# EAGLE design Adafruit Metro M4 Express (EAGLE 6.6.0)
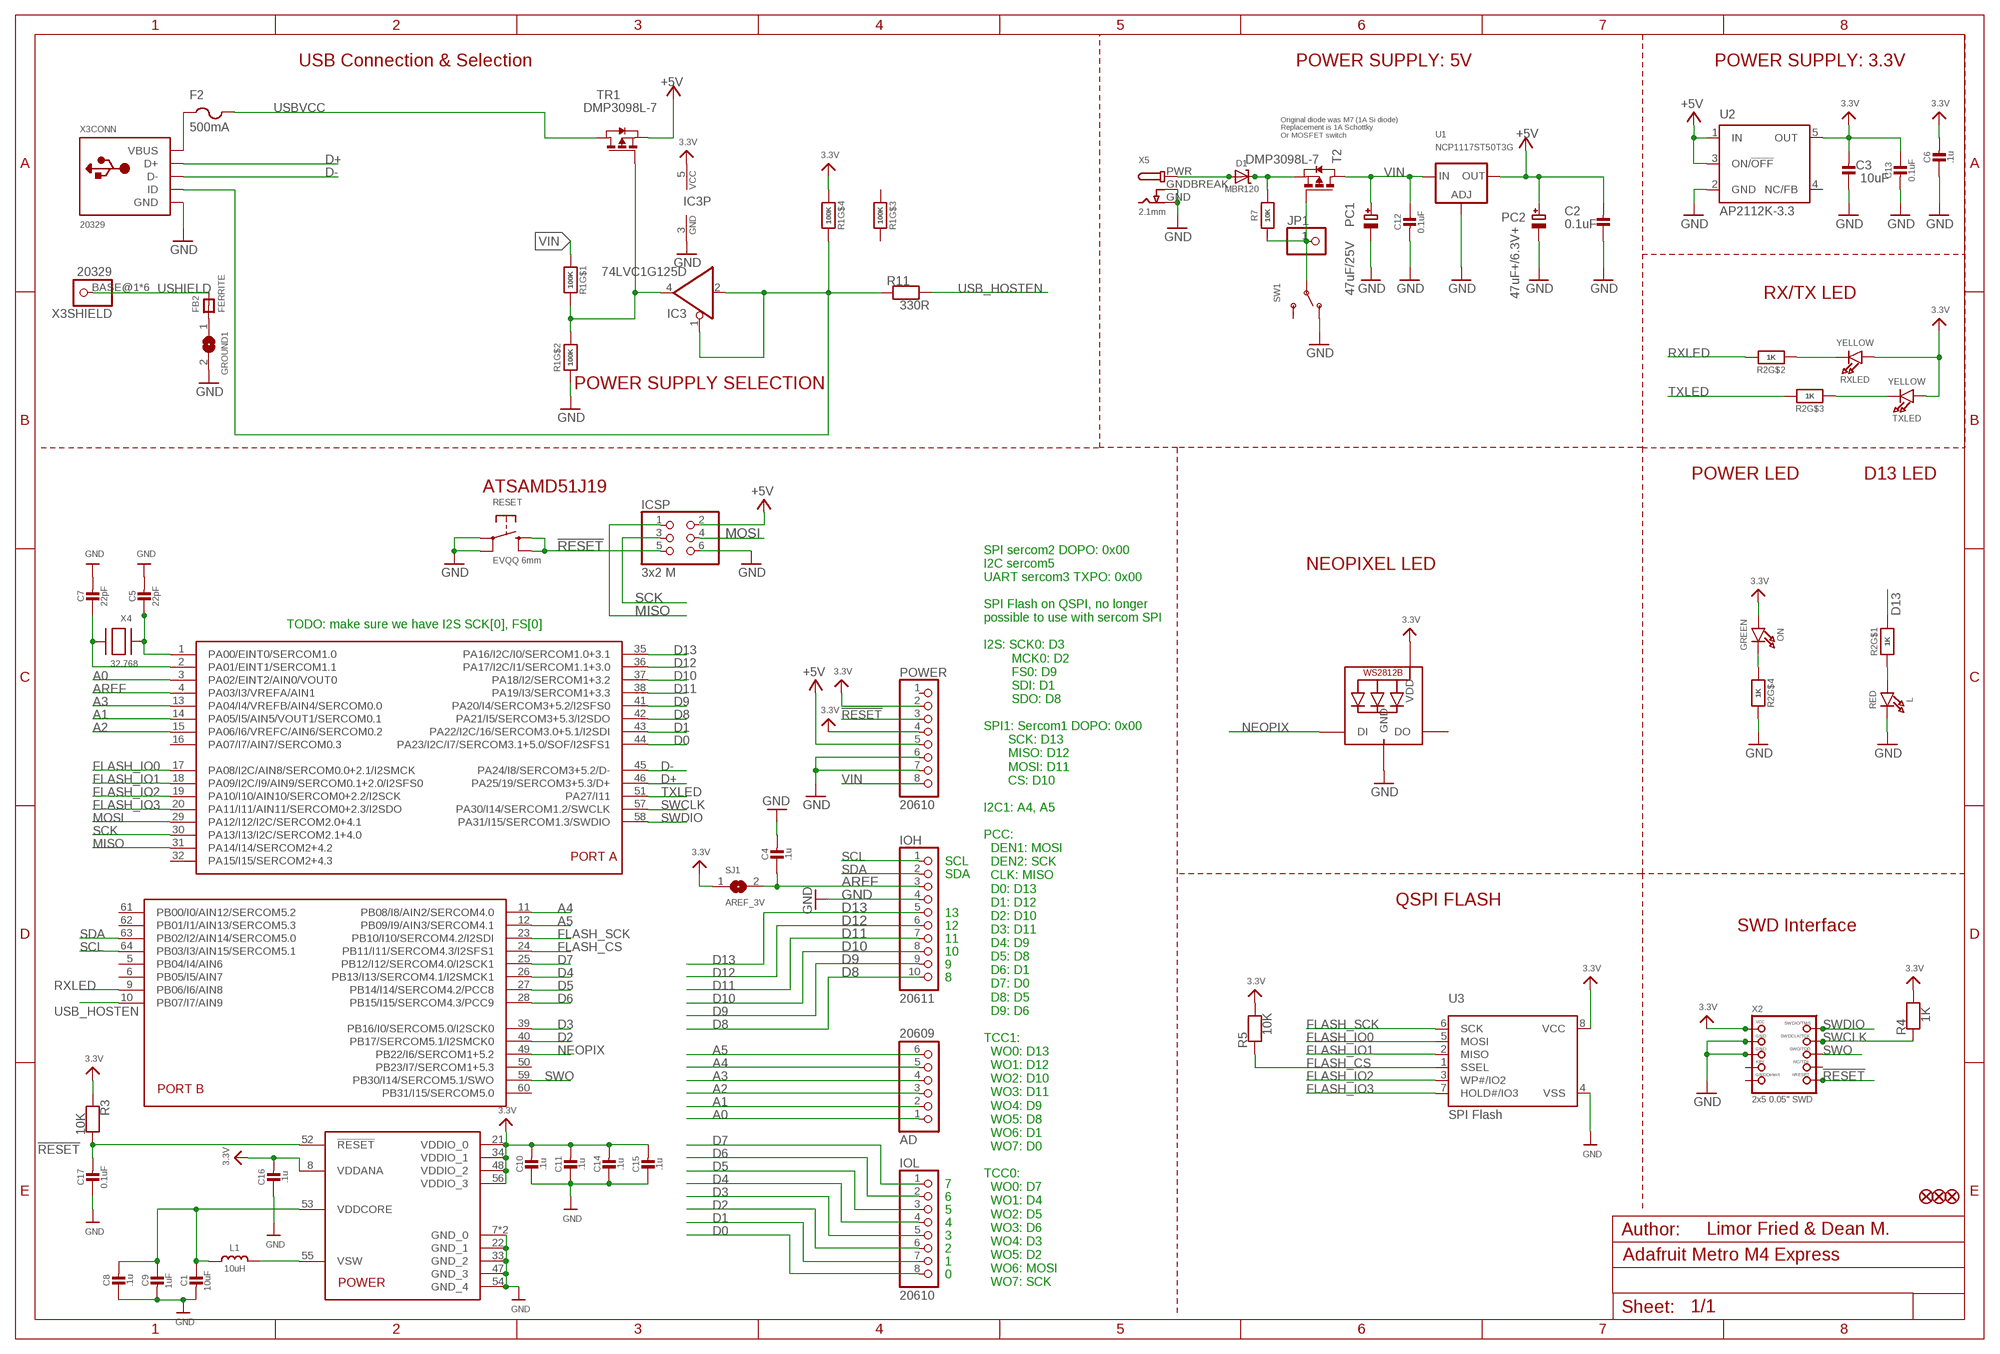
[diagram p0: schematic, sheet 1]

## Parts
AD  20609  HEADER-1X6OVALWAVE  [1X06_OVALWAVE]
C1  10uF  CAP_CERAMIC0805-NOOUTLINE  [0805-NO]
C2  0.1uF  CAP_CERAMIC0805-NOOUTLINE  [0805-NO]
C3  10uF  CAP_CERAMIC0805-NOOUTLINE  [0805-NO]
C4  .1u  CAP_CERAMIC0603_NO  [0603-NO]
C5  22pF  CAP_CERAMIC0603_NO  [0603-NO]
C6  .1u  CAP_CERAMIC0603_NO  [0603-NO]
C7  22pF  CAP_CERAMIC0603_NO  [0603-NO]
C8  .1u  CAP_CERAMIC0603_NO  [0603-NO]
C9  1uF  CAP_CERAMIC0603_NO  [0603-NO]
C10  .1u  CAP_CERAMIC0603_NO  [0603-NO]
C11  .1u  CAP_CERAMIC0603_NO  [0603-NO]
C12  0.1uF  CAP_CERAMIC0603_NO  [0603-NO]
C13  0.1uF  CAP_CERAMIC0603_NO  [0603-NO]
C14  .1u  CAP_CERAMIC0603_NO  [0603-NO]
C15  .1u  CAP_CERAMIC0603_NO  [0603-NO]
C16  .1u  CAP_CERAMIC0603_NO  [0603-NO]
C17  0.1uF  CAP_CERAMIC0603_NO  [0603-NO]
D1  MBR120  DIODE-SCHOTTKYSOD-123  [SOD-123]
F2  500mA  PTCFUSE-1206  [R1206]
FB2  FERRITE  FERRITE-0805NO  [0805-NO]
FD1  FIDUCIAL_1MM  [FIDUCIAL_1MM]
FD2  FIDUCIAL_1MM  [FIDUCIAL_1MM]
FD3  FIDUCIAL_1MM  [FIDUCIAL_1MM]
GROUND1  SOLDERJUMPERCLOSED  [SOLDERJUMPER_CLOSEDWIRE]
IC3  74LVC1G125D  74AHC1G125DBV  [SOT23-5]
ICSP  3x2 M  HEADER-2X3  [2X03_ROUND_70MIL]
IOH  20611  HEADER-1X10OVALWAVE  [1X10_OVALWAVE]
IOL  20610  HEADER-1X8OVALWAVE  [1X08_OVALWAVE]
JP1  HEADER-1X1ROUND  [1X01_ROUND]
L  RED  LED0805_NOOUTLINE  [CHIPLED_0805_NOOUTLINE]
L1  10uH  INDUCTOR  [INDUCTOR_1007]
LED1  WS2812B3535  [LED3535]
ON  GREEN  LED0805_NOOUTLINE  [CHIPLED_0805_NOOUTLINE]
PC1  47uF/25V  CAP_ELECTROLYTICPANASONIC_D  [PANASONIC_D]
PC2  47uF+/6.3V+  CAP_ELECTROLYTICPANASONIC_D  [PANASONIC_D]
POWER  20610  HEADER-1X8OVALWAVE  [1X08_OVALWAVE]
R1  100K  RESISTOR_4PACK  [RESPACK_4X0603]
R2  1K  RESISTOR_4PACK  [RESPACK_4X0603]
R3  10K  RESISTOR_0603_NOOUT  [0603-NO]
R4  1K  RESISTOR_0603_NOOUT  [0603-NO]
R5  10K  RESISTOR_0603_NOOUT  [0603-NO]
R7  10K  RESISTOR_0603_NOOUT  [0603-NO]
R11  330R  RESISTOR_0603_NOOUT  [0603-NO]
RESET  EVQQ 6mm  SWITCH_TACT_SMT  [EVQ-Q2]
RXLED  YELLOW  LED0805_NOOUTLINE  [CHIPLED_0805_NOOUTLINE]
SJ1  AREF_3V  SOLDERJUMPERCLOSED  [SOLDERJUMPER_CLOSEDWIRE]
SW1  SWITCH_SPDT  [SPDT_SMT_SSSS811101]
T2  DMP3098L-7  PMOSSOT23  [SOT-23]
TR1  DMP3098L-7  0297_PMV48XP  [SOT-23]
TXLED  YELLOW  LED0805_NOOUTLINE  [CHIPLED_0805_NOOUTLINE]
U1  NCP1117ST50T3G  LM1117SOT223-REFLOW  [SOT223-R]
U2  AP2112K-3.3  LP2985-XXDBVR33  [SOT23-DBV]
U3  SPI Flash  SPIFLASH_SOIC8208MIL  [SOIC8_208MIL]
U$1  ATSAMD51J  [PQFN64-1]
X2  2x5 0.05" SWD  JTAG-CORTEXBOXPOSTS  [2X05_1.27MM_BOX_POSTS]
X3  20329  USB_W_SHIELD_V2  [4UCONN_20329_V2]
X4  32.768  XTAL-3.2X1.5  [XTAL3215]
X5  2.1mm  DCBARRELPTH  [DCJACK_2MM_PTH]

## Nets
3.3V: C3.2 C6.2 C10.2 C11.2 C13.1 C14.2 C15.2 C16.2 IC3.5(VCC) LED1.2(VDD) ON.A POWER.2 POWER.4 R1.4 R3.1 R4.2 R5.2 RXLED.A SJ1.1 TXLED.A U2.5(OUT) U3.8(VCC) U$1.8(VDDANA) U$1.21(VDDIO_0) U$1.34(VDDIO_1) U$1.48(VDDIO_2) U$1.56(VDDIO_3) X2.1(VCC)
!RESET: C17.2 ICSP.5 POWER.3 R3.2 RESET.B'(S1) RESET.B(S) U$1.52(!RESET) X2.10(NRESET)
+5V [usbvcc]: C2.2 ICSP.2 PC2.+ POWER.5 TR1.2(S) U1.2(OUT) U1.4(OUT) U2.1(IN) U2.3(ON/!OFF)
A0: AD.1 U$1.3(PA02/EINT2/AIN0/VOUT0)
A1: AD.2 U$1.14(PA05/I5/AIN5/VOUT1/SERCOM0.1)
A2: AD.3 U$1.15(PA06/I6/VREFC/AIN6/SERCOM0.2)
A3: AD.4 U$1.13(PA04/I4/VREFB/AIN4/SERCOM0.0)
A4: AD.5 U$1.11(PB08/I8/AIN2/SERCOM4.0)
A5: AD.6 U$1.12(PB09/I9/AIN3/SERCOM4.1)
AREF [aref]: C4.1 IOH.3 SJ1.2 U$1.4(PA03/I3/VREFA/AIN1)
D0: IOL.8 U$1.44(PA23/I2C/I7/SERCOM3.1+5.0/SOF/I2SFS1)
D1: IOL.7 U$1.43(PA22/I2C/16/SERCOM3.0+5.1/I2SDI)
D2: IOL.6 U$1.40(PB17/SERCOM5.1/I2SMCK0)
D3: IOL.5 U$1.39(PB16/I0/SERCOM5.0/I2SCK0)
D4: IOL.4 U$1.26(PB13/I13/SERCOM4.1/I2SMCK1)
D5: IOL.3 U$1.27(PB14/I14/SERCOM4.2/PCC8)
D6: IOL.2 U$1.28(PB15/I15/SERCOM4.3/PCC9)
D7: IOL.1 U$1.25(PB12/I12/SERCOM4.0/I2SCK1)
D8: IOH.10 U$1.42(PA21/I5/SERCOM3+5.3/I2SDO)
D9: IOH.9 U$1.41(PA20/I4/SERCOM3+5.2/I2SFS0)
D10: IOH.8 U$1.37(PA18/I2/SERCOM1+3.2)
D11: IOH.7 U$1.38(PA19/I3/SERCOM1+3.3)
D12: IOH.6 U$1.36(PA17/I2C/I1/SERCOM1.1+3.0)
D13: IOH.5 R2.8 U$1.35(PA16/I2C/I0/SERCOM1.0+3.1)
D+ [USB]: U$1.46(PA25/19/SERCOM3+5.3/D+) X3.D+(CONN:D+)
D- [USB]: U$1.45(PA24/I8/SERCOM3+5.2/D-) X3.D-(CONN:D-)
FLASH_CS: R5.1 U3.1(SSEL) U$1.24(PB11/I11/SERCOM4.3/I2SFS1)
FLASH_IO0: U3.5(MOSI) U$1.17(PA08/I2C/AIN8/SERCOM0.0+2.1/I2SMCK)
FLASH_IO1: U3.2(MISO) U$1.18(PA09/I2C/I9/AIN9/SERCOM0.1+2.0/I2SFS0)
FLASH_IO2: U3.3(WP#/IO2) U$1.19(PA10/I10/AIN10/SERCOM0+2.2/I2SCK)
FLASH_IO3: U3.7(HOLD#/IO3) U$1.20(PA11/I11/AIN11/SERCOM0+2.3/I2SDO)
FLASH_SCK: U3.6(SCK) U$1.23(PB10/I10/SERCOM4.2/I2SDI)
GND [gnd]: C1.2 C2.1 C3.1 C4.2 C5.2 C6.1 C7.2 C8.1 C9.2 C10.1 C11.1 C12.2 C13.2 C14.1 C15.1 C16.1 C17.1 GROUND1.2 IC3.3(GND) ICSP.6 IOH.4 L.C LED1.4(GND) PC1.- PC2.- POWER.6 POWER.7 R1.2 R2.5 RESET.A'(P1) RESET.A(P) SW1.A(O) U1.1(ADJ) U2.2(GND) U3.4(VSS) U$1.7(GND_0) U$1.22(GND_1) U$1.33(GND_2) U$1.47(GND_3) U$1.54(GND_4) U$1.EXP(GND_0) X2.3(GND) X2.5(GND) X3.GND(CONN:GND) X5.GND X5.GNDBREAK
MISO: ICSP.1 U$1.31(PA14/I14/SERCOM2+4.2)
MOSI: ICSP.4 U$1.29(PA12/I12/I2C/SERCOM2.0+4.1)
N$1: L.A R2.1
N$2: FB2.1 GROUND1.1
N$3: ON.C R2.4
N$4: L1.P$2 U$1.55(VSW)
N$5: R2.2 RXLED.C
N$7: R2.3 TXLED.C
N$9: C5.1 U$1.1(PA00/EINT0/SERCOM1.0) X4.P$1
N$10: IC3.1(OE) IC3.2(I) R1.5 R11.1 X3.ID(CONN:ID)
N$11: IC3.4(O) R1.7 R1.8 TR1.3(G)
N$12: C7.1 U$1.2(PA01/EINT1/SERCOM1.1) X4.P$2
N$15: D1.C R7.2 T2.2(S)
NEOPIX: LED1.1(DI) U$1.49(PB22/I6/SERCOM1+5.2)
PWR_SWITCH: JP1.1 R7.1 SW1.B(P) T2.3(G)
PWRIN [USB]: D1.A X5.PWR
RXLED: R2.7 U$1.9(PB06/I6/AIN8)
SCK: ICSP.3 U$1.30(PA13/I13/I2C/SERCOM2.1+4.0)
SCL: IOH.1 U$1.64(PB03/I3/AIN15/SERCOM5.1)
SDA: IOH.2 U$1.63(PB02/I2/AIN14/SERCOM5.0)
SWCLK: R4.1 U$1.57(PA30/I14/SERCOM1.2/SWCLK) X2.4(SWDCLK)
SWDIO: U$1.58(PA31/I15/SERCOM1.3/SWDIO) X2.2(SWDIO)
SWO: U$1.59(PB30/I14/SERCOM5.1/SWO) X2.6(SWO)
TXLED: R2.6 U$1.51(PA27/I11)
USB_HOSTEN: R11.2 U$1.10(PB07/I7/AIN9)
USBVCC [usbvcc]: F2.2 TR1.1(D)
USHIELD [gnd]: FB2.2 X3.BASE@1 X3.BASE@2 X3.SPRT@1 X3.SPRT@2 X3.SPRT@3 X3.SPRT@4
VBUS: F2.1 X3.VBUS(CONN:VBUS)
VDDCORE: C1.1 C8.2 C9.1 L1.P$1 U$1.53(VDDCORE)
VIN [USB]: C12.1 PC1.+ POWER.8 R1.1 T2.1(D) U1.3(IN)
Unconnected: LED1.3(DO) POWER.1 R1.3 R1.6 SW1.C(S) U2.4(NC/FB) U$1.5(PB04/I4/AIN6) U$1.6(PB05/I5/AIN7) U$1.16(PA07/I7/AIN7/SERCOM0.3) U$1.32(PA15/I15/SERCOM2+4.3) U$1.50(PB23/I7/SERCOM1+5.3) U$1.60(PB31/I15/SERCOM5.0) U$1.61(PB00/I0/AIN12/SERCOM5.2) U$1.62(PB01/I1/AIN13/SERCOM5.3) X2.7(KEY) X2.8(TDI) X2.9(GNDDETECT)

## Notes on the sheet
- USB Connection & Selection | POWER SUPPLY: 5V | POWER SUPPLY: 3.3V
- Original diode was M7 (1A Si diode)
  Replacement is 1A Schottky
  Or MOSFET switch
- RX/TX LED
- POWER SUPPLY SELECTION
- POWER LED | D13 LED
- ATSAMD51J19
- NEOPIXEL LED
- TODO: make sure we have I2S SCK[0], FS[0]
- SCL
- SDA
- QSPI FLASH
- 13
- 12 | SWD Interface
- 11
- 10
- 9
- 8
- 7
- 6
- 5
- 4
- 3 | Limor Fried & Dean M.
- 2
- 1
- 0
- SPI sercom2 DOPO: 0x00
  I2C sercom5
  UART sercom3 TXPO: 0x00
  
  SPI Flash on QSPI, no longer
  possible to use with sercom SPI
  
  I2S: SCK0: D3
          MCK0: D2
          FS0: D9
          SDI: D1
          SDO: D8
  
  SPI1: Sercom1 DOPO: 0x00
         SCK: D13
         MISO: D12
         MOSI: D11
         CS: D10
  
  I2C1: A4, A5
  
  PCC:
    DEN1: MOSI
    DEN2: SCK
    CLK: MISO
    D0: D13
    D1: D12
    D2: D10
    D3: D11
    D4: D9
    D5: D8
    D6: D1
    D7: D0
    D8: D5
    D9: D6
  
  TCC1:
    WO0: D13
    WO1: D12
    WO2: D10
    WO3: D11
    WO4: D9
    WO5: D8
    WO6: D1
    WO7: D0
  
  TCC0:
    WO0: D7
    WO1: D4
    WO2: D5
    WO3: D6
    WO4: D3
    WO5: D2
    WO6: MOSI
    WO7: SCK

## Library data of the parts
AD = microbuilder:HEADER-1X6: PIN HEADER
C1-C17 = microbuilder:CAP_CERAMIC: Ceramic Capacitors For new designs, use the packages preceded by an '_' character since they are more reliable: The following footprints should be used on most boards: _0402 - Standard footprint for regular board layouts _0603 - Standard footprint for regular board layouts _0805 - Standard footprint for regular board layouts _1206 - Standard footprint for regular board layouts For extremely tight-pitch boards where space is at a premium, the following 'micro-pitch' footprints can be used (smaller pads, no silkscreen outline, etc.): _0402MP - Micro-pitch footprint for very dense/compact boards _0603MP - Micro-pitch footprint for very dense/compact boards _0805MP - Micro-pitch footprint for very dense/compact boards _1206MP - Micro-pitch footprint for very dense/compact boards
D1 = microbuilder:DIODE-SCHOTTKY
F2 = adafruit:PTCFUSE: PTC fuses, resettable thermistors
FB2 = microbuilder:FERRITE: Ferrite Bead 0603 MMZ1608B121C - 120 Ohm @ 100MHz, 600mA, 0.15 Ohm DC Resistance - Digikey: 445-2164-1-ND BK1608HW121-T - 120 Ohm, 600mA Ferrite Chip - Digikey: 587-1876-2-ND 0805 HZ0805B272R-10 - 2.7K Ohm @ 100MHz, 200mA, 0.8 Ohm DC Resistance - Digikey: 240-2504-1-ND (see also Murata BLM21BD272SN1L) MMZ2012Y152B - 1.5K Ohm @ 100MHz, 500mA, 0.4 Ohm DC Resistance - Digikey: 445-1560-1-ND - Mainly for high frequency (80-400MHz) MMZ2012R102A - 1K Ohm @ 100MHz, 500mA, 0.3 Ohm DC Resistance - Digikey: 445-1555-2-ND - More general purpose (10-200MHz)
FD1-FD3 = microbuilder:FIDUCIAL: Fiducial Alignment Points Various fiducial points for machine vision alignment.; BOM: EXCLUDE
GROUND1 SJ1 = microbuilder:SOLDERJUMPER: SMD Solder JUMPER Solder the two pads together to create a connection, or remove the solder to break it. REFLOW - Use this footprint for solder paste and reflow ovens. WAVE - Use this footprint for hand-soldering (larger pads). CLOSED - Has a trace between the two pads to ensure it is closed by default. The trace needs to be cut to disable the jumper, and can be closed again by creating a solder bridge between the two pads.
IC3 = 74xx-little-de:74*1G125: Single Bus Buffer Gate with 3-State Output
ICSP = microbuilder:HEADER-2X3: PIN HEADER
IOH = microbuilder:HEADER-1X10: PIN HEADER
IOL POWER = microbuilder:HEADER-1X8: PIN HEADER
JP1 = microbuilder:HEADER-1X1: PIN HEADER
L ON RXLED TXLED = microbuilder:LED: LED 0603 - 0603 Surface Mount Package 2mA: Green LED - Low Power (3.9mcd, 2ma, 1.7Vf) - Digikey: 475-2709-2-ND Orange LED - Low Power (9.8mcd, 2ma, 1.8Vf) - Digikey: 475-1194-2-ND Red LED - Low Power (5mcd, 2ma, 1.8Vf) - Digikey: 475-1195-2-ND Yellow LED - Low Power (7mcd, 2ma, 1.8Vf) - Digikey: 475-1196-2-ND 5mA: Blue LED - Low Power (17mcd, 5ma, 2.9Vf) - Digikey: LNJ937W8CRACT-ND 0805 - 0805 Surface Mount Package 2mA: Red LED (8.8mcd, 2mA, 1.8Vf, Clear) - Low Power [Digikey: 475-2510-1-ND] Green LED (5mcd, 2mA, 1.8Vf, Clear) - Low Power [Digikey: 475-2730-1-ND] Yellow LED (11.3mcd, 2mA, 1.8Vf, Clear) - Low Power [Digikey: 475-2555-1-ND] 20mA: Red LED (104mcd, 20mA, Diffused) - LS R976 [Digikey: 475-1278-6-ND] Red LED (12mcd, 20mA, 2.0Vf, Clear) - APT2012EC [Digikey: 754-1128-1-ND] Green LED (15mcd, 20mA, 2.2Vf, Clear) - APT2012GC [Digikey: 754-1131-1-ND] Orange LED (160mcd, 20mA, 2.1Vf, Clear) - APT2012SECK [Digikey: 754-1130-1-ND] 1206 - 1206 Surface Mount Package Green LED (26mcd, 20mA, Diffused) - LG N971 [Digikey: 475-1407-6-ND] Red LED (15mcd, 20mA, Diffused) - LH N974 [Digikey: 475-1416-6-ND] Cree - Cree High-Power Surface Mount LEDs XPEBWT-L1-0000-00D50 - White 111lm 350mA 2.9Vf 6200K 110° XTEAWT-00-0000-00000LEE3 - White 114lm 350mA 2.85Vf 5000K 115° Everlight - Everlight 45-21 Series Surface Mount LEDs 45-21/QK2C-B2832AC2CB2/2T - Warm White 2000mcd 20mA 3.25Vf 3050K 120° 45-21/LK2C-B38452C4CB2/2T - Nuetral White 2000mcd 20mA 3.25Vf 4150K 120° 45-21/LK2C-B50634C6CB2/2T - Cold White 2200mcd 20mA 3.25Vf 5650K 120° PLCC2 Reverse Mount LS T77K-J1L2-1-0-2-R18-Z - Red 11.25mcd 2mA 1.8Vf 630nm 120° LO T77K-L1M2-24-Z - Orange 19.6mcd 2mA 1.8Vf 606nm 120° LY T77K-K2M1-26-Z - Yellow 15.7mcd 2mA 1.8Vf 587nm 120°
L1 = microbuilder:INDUCTOR: Inductors 0603: 10nH Ceramic Inductor - microwire antenna/RF (Digikey: 712-1434-2-ND) 0805: 560nH Ceramic Inductor - RF (Digikey: 553-1047-1-ND) 270nH Ceramic Inductor - Q = 40@250MHz, +-5%, 1 Ohm DC Resistance (Digikey: 535-10506-2-ND) 1007 (2518 Metric) SMT: 10µH 10% 250mOhm 820mA 1007 Inductor (Digikey: 587-2189-1-ND) 22µH 10% 500mOhm 580mA 1007 Inductor (Digikey: 587-2190-1-ND) 47µH 10% 950mOhm 420mA 1007 Inductor (Digikey: 587-2191-1-ND) 47µH 5% 100mOhm 1A 1008 Inductor (Digikey: 732-1816-1-ND) 5.0x5.0mm (Taiyo Yuden NR5040 Series) 6.8µH 20% 2.3A 64mOhm Inductor (Digikey: 587-2374-2-ND) 5.0x5.0mm (TDK VLC5045 Series) 4.7µH 20% 3.3A 34mOhm Inductor (Digikey: 445-6526-1-ND) 6.8µH 20% 2.7A 46mOhm Inductor (Digikey: 445-6527-1-ND) 6.0x6.0mm (TDK VLC6045 Series) 4.7µH 20% 3.8A 27mOhm Inductor (Digikey: 445-6538-2-ND) 6.8µH 20% 3A 41mOhm Inductor (Digikey: 445-6540-1-ND) 6.2µH 30% 2.2A 45mOhm Inductor (Digikey: SRR5028-6R2YCT-ND) - Not TDK VLC6045 but footprint should match 6.0x6.0mm (TDK SLF6045 Series) 6.8uH 30% 2A 33mOhm Inductor (Digikey: 445-4572-1-ND, Mouser: 810-SLF645T6R8N2R0PF) 6.0x6.0mm (Sumida CDRH5D28 Series) 6.2uH 30% 1.8A 45mOhm Inductor (Digikey: 308-1542-1-ND) Taiyo Yuden NR3015T2R2M - 2.2uH 20% 1.5A (Digikey: 587-1648-2-ND, Mouser: 963-NR3015T2R2M) - Used with TI TPS62172 CoilCraft RFID Transponder Coil - MA5532-AE (For use with AS3935 Lightning Sensor) Taiyo Yuden NRH2412T2R2MNGH - 2.2uH 20% 1AA (Digikey: 587-3443-1-ND) - Used with TI LM3671 Vishay IHLP 1.0uH Molded Inductor - 24mOhm DCR, 5A, +/-20%, -55°C-125°C (Digikey: 541-1319-1-ND)
LED1 = microbuilder:WS2812B
PC1 PC2 = microbuilder:CAP_ELECTROLYTIC: Electrolytic Capacitors SMT PANASONIC_C - Size C Panasonic Electrolytic Aluminum Capacitor 47µF 16V 20% Electrolytic Capacitor [Digikey: PCE3890TR-ND] PANASONIC_D - Size D Panasonic Electrolytic Aluminum Capacitor 100µF 25V 20% Electrolytic Capacitor [Digikey: PCE3898TR-ND] PTH 3.5 mm grid, 8 mm diameter ... 3.5 mm grid, 10 mm diameter ...
R1 R2 = microbuilder:RESISTOR_4PACK: Resistor Packs (4 resistors) 4 x 0603 10K 1/16W - Digikey: YC164J-10KCT-ND
R3-R5 R7 R11 = microbuilder:RESISTOR: Resistors For new designs, use the packages preceded by an '_' character since they are more reliable: The following footprints should be used on most boards: _0402 - Standard footprint for regular board layouts _0603 - Standard footprint for regular board layouts _0805 - Standard footprint for regular board layouts _1206 - Standard footprint for regular board layouts For extremely tight-pitch boards where space is at a premium, the following 'micro-pitch' footprints can be used (smaller pads, no silkscreen outline, etc.): _0402MP - Micro-pitch footprint for very dense/compact boards _0603MP - Micro-pitch footprint for very dense/compact boards _0805MP - Micro-pitch footprint for very dense/compact boards _1206MP - Micro-pitch footprint for very dense/compact boards
RESET = microbuilder:SWITCH_TACT_SMT: SMT Tact Switches 6x6mm - Digikey: P12940SCT-ND KMR2 (4.6x2.8mm) - Digikey: 401-1426-1-ND EVQ-PQHB55 - Light Touch, 160GF (4.5x4.5mm) - Digikey: P8090SCT-ND KMT0 - KMT021 NGJ LHS (etc.) IP68/Waterproof - Digikey: CKN10289CT-ND
SW1 = microbuilder:SWITCH_SPDT: Switch - SPDT SSSS811101 - Horizontal Two Position SMT, 0.3A 4V [Mouser: 688-SSSS811101]
T2 = zetex:PMOSSOT23: MOS FET; OC_FARNELL: unknown; OC_NEWARK: unknown
TR1 = Transistors:0297_PMV48XP: 20 V, 3.5 A P-channel Trench MOSFET - PMV48XP; CASE: SOT23; MONTHLY_USAGE: _____; PART_NUMBER: PMV48XP; PRICE: _____; SUPPLIER: _____; TYPE: Transistor; VALUE: PMV48XP
U1 = microbuilder:LM1117: LM1117 Voltage Regulator LM1117 Adjustable Voltage regulator [Digikey: LM1117IMP-ADJDKR-ND] LM1117 3.3V Voltage regulator [AP1117E33GDIDKR-ND] LM1117 5.0V Voltage regulator [AP1117E50GDIDKR-ND] SOT223-REFLOW - SOT223 package for solder paste/reflow ovens SOT223-WAVE - SOT223 package for hand-soldering (larger pads) Note: For the fixed-voltage regulators, simply set the ADJ pin to GND.
U2 = SmartPrj:LP2985-XXDBVR: ULTRALOW-POWER 50-mA LOW-DROPOUT LINEAR REGULATORS 50-mA Low-Dropout Regulator Source: http://focus.ti.com/lit/ds/symlink/tps77001.pdf
U3 = microbuilder:SPIFLASH_SOIC8: SOIC8 SPI Flash Be careful with the size since SOIC8 flash comes in several 'widths' SOIC8 150 mil M25P16 - 16Mbit (2Mbit x 8) Serial Flash (75MHz SPI Bus), Supply: 2.7-3.6V Digikey: SOIC8 - M25P16-VMN6P-ND SOIC8 208 mil W25Q16BVSSIG - 16Mbit (2Mbit x 8) Serial Flash (104MHz SPI Bus), Supply: 2.7-3.6V Digikey: SOIC8 - W25Q16BVSSIG-ND
U$1 = microbuilder:ATSAMD51J: ATSAMD51J cortex m4 microcontroller
X2 = microbuilder:JTAG-CORTEX: Serial Wire (SW-DP) Connector Standard 0.05" 10-pin connector is for use with the Cortex M and Cortex A SWD (serial wire debugger) interface (SW-DP) Connectors 2x05_1.27MM_SMT - Inexpensive surface-mount header with bare pins, compatible with standard 10-pin SWD cables (4UCON: 16846) 2x05_1.27MM_BOX_NOPOSTS - Polarised surface-mount box (4UCON with caps: 19735, without caps: 15117 2x05_1.27MM_BOX_POSTS - Polarised surface-mount box with mounting holes (4UCON: 20317) Pinout: http://infocenter.arm.com/help/topic/com.arm.doc.faqs/attached/13634/cortex_debug_connectors.pdf http://www.keil.com/peripherals/coresight/connectors.asp
X3 = microbuilder:USB_W_SHIELD
X4 = adafruit2:XTAL: Low cost SMT crystals, no capacitors included http://www.ladyada.net/library/eagle
X5 = microbuilder:DCBARREL: DC Barrel Jack DCJACK_1.3MM_PTH - Through Hole 1.3mm Jack (4UConnector: 05536) DCJACK_2MM_PTH - Through Hole 2.0/2.1 Jack (4UConnector: 05537) DCJACK_2MM_SMT - SMT 2.0/2.1mm Jack(4UConnector: 03267)

## Board
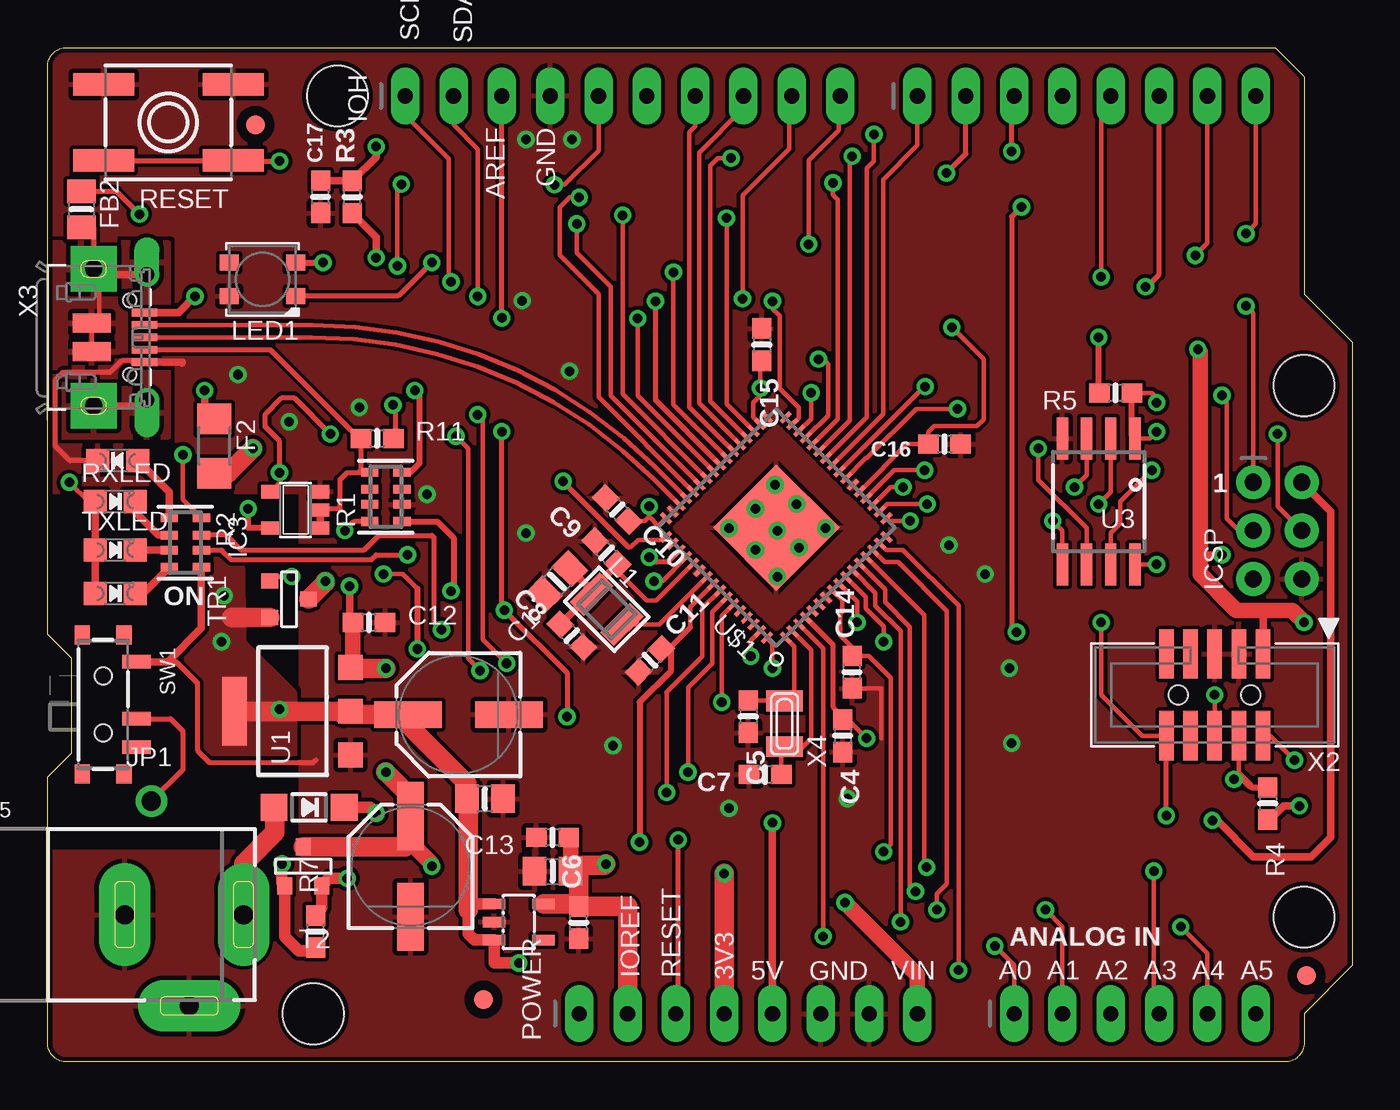
[diagram p1: board, top side]
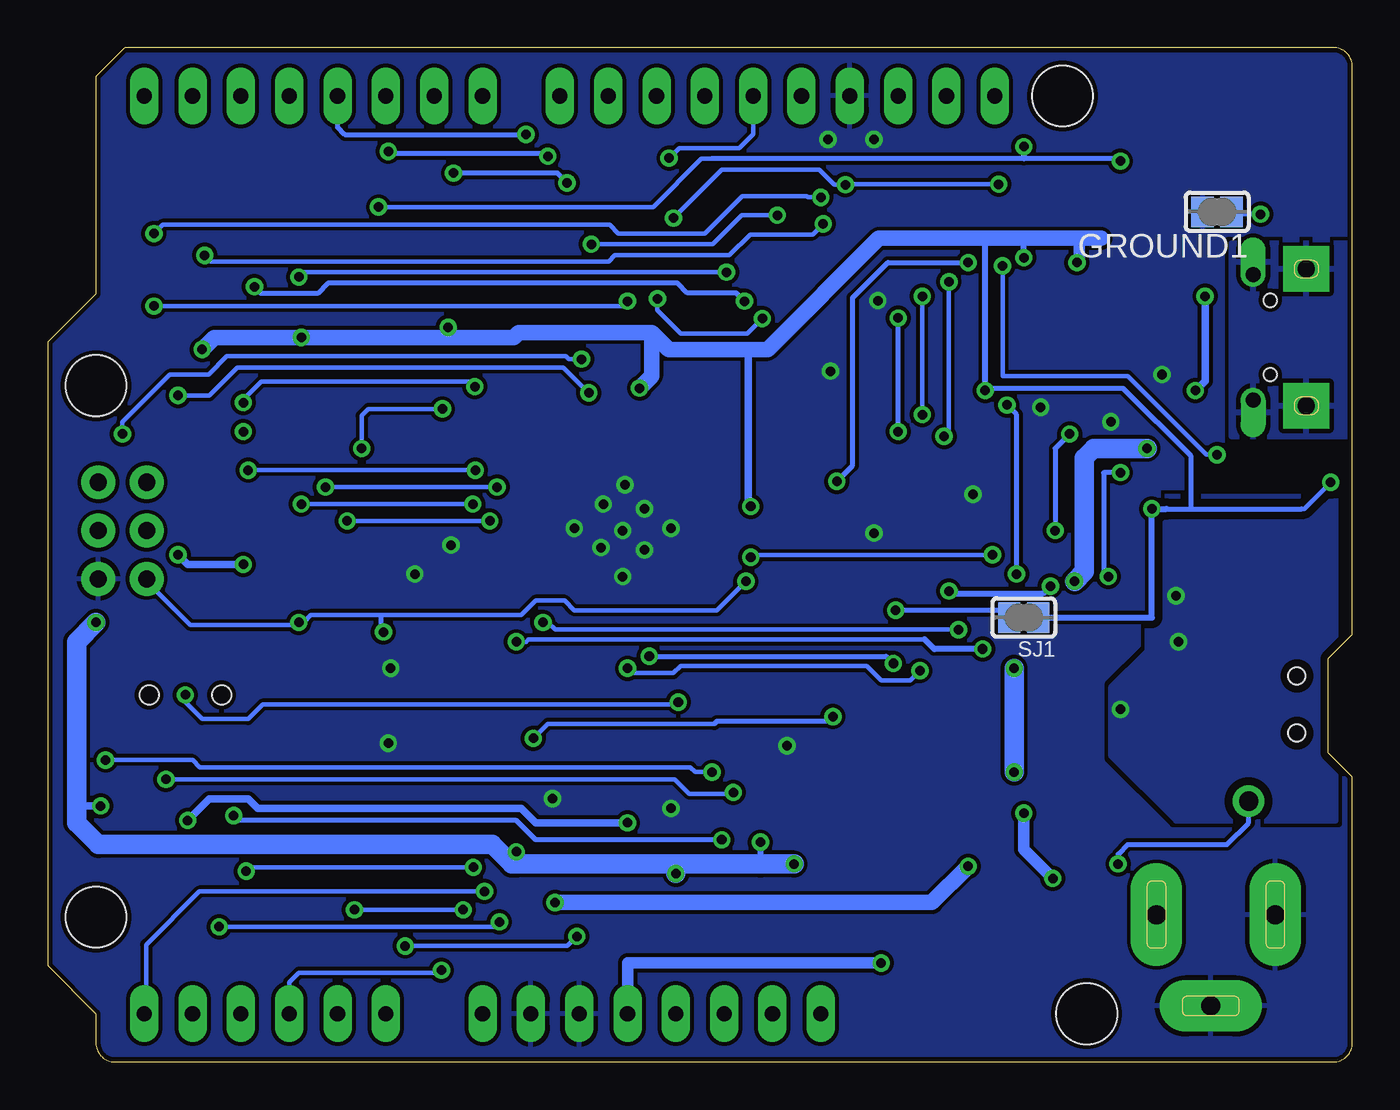
[diagram p2: board, bottom side, seen from below]

Size 68.58 x 53.34 mm. Coordinates in mm from the lower left corner, seen from the top.
Outline: 64.52,53.34 66.04,51.82 66.04,40.39 68.58,37.85 68.58,5.08 66.04,2.54 66.04,1 arc-90 65.04,0 1,0 arc-90 0,1 0,14.99 1.27,16.26 1.27,21.21 0,22.48 0,52.34 arc-90 1,53.34 64.52,53.34
Copper layers (1*16): Top 0.035mm / dielectric 1.5mm / Bottom 0.035mm
Design rules "adafruit *": minimum track width 8mil, minimum drill 15.5mil, track to track 8mil, track to pad 8mil, pad to pad 8mil, via to via 8mil, smd to smd 8mil, copper to edge 10mil, drill to drill 8mil, minimum pad ring 10mil, minimum via ring 8mil, stop-mask expansion 2mil, vias tented up to drill 20mil, thermal gap 10mil
Holes 3.2 mm at 66.04,35.56 66.04,7.62 15.24,50.8 13.97,2.54

### Footprints (pad centres in the part's own frame; a part is rotated, then mirrored left to right if it is on the bottom)
1X06_OVALWAVE = drill 0.8 pad 1.5 long: 1 -6.35,0; 2 -3.81,0; 3 -1.27,0; 4 1.27,0; 5 3.81,0; 6 6.35,0
0805-NO = smd 1.24 x 1.5: 1 -0.95,0; 2 0.95,0
0603-NO = smd 1.075 x 1: 1 -0.85,0; 2 0.85,0
SOD-123 = smd 1.4 x 1.4: A 1.85,0; C -1.85,0
R1206 = smd 1.6 x 1.803: 1 -1.422,0; 2 1.422,0
FIDUCIAL_1MM = smd 1 x 1: 1 0,0
SOLDERJUMPER_CLOSEDWIRE = smd 1.168 x 1.6: 1 -0.762,0; 2 0.762,0 | smd 0.635 x 0.203: WIRE 0,0
SOT23-5 = smd 0.69 x 0.99: 1 -0.95,-1.29; 2 0,-1.29; 3 0.95,-1.29; 4 0.95,1.3; 5 -0.95,1.3
2X03_ROUND_70MIL = drill 0.9 pad 1.778: 1 -2.54,-1.27; 2 -2.54,1.27; 3 0,-1.27; 4 0,1.27; 5 2.54,-1.27; 6 2.54,1.27
1X10_OVALWAVE = drill 0.8 pad 1.5 long: 1 -11.43,0; 2 -8.89,0; 3 -6.35,0; 4 -3.81,0; 5 -1.27,0; 6 1.27,0; 7 3.81,0; 8 6.35,0; 9 8.89,0; 10 11.43,0
1X08_OVALWAVE = drill 0.8 pad 1.5 long: 1 -8.89,0; 2 -6.35,0; 3 -3.81,0; 4 -1.27,0; 5 1.27,0; 6 3.81,0; 7 6.35,0; 8 8.89,0
1X01_ROUND = drill 1 pad 1.676: 1 0,0
CHIPLED_0805_NOOUTLINE = smd 1.2 x 1.2: A 0,-1.05; C 0,1.05
INDUCTOR_1007 = smd 1.016 x 2.2: P$1 -1.127,0; P$2 1.127,0
LED3535 = smd 1 x 0.85: 1 -1.75,0.875; 2 -1.75,-0.875; 3 1.75,-0.875; 4 1.75,0.875
PANASONIC_D = smd 3.556 x 1.4: + 2.654,0; - -2.654,0
RESPACK_4X0603 = smd 0.45 x 0.9: 1 -1.3,-0.85; 2 -0.4,-0.85; 3 0.4,-0.85; 4 1.3,-0.85; 5 1.3,0.85; 6 0.4,0.85; 7 -0.4,0.85; 8 -1.3,0.85
EVQ-Q2 = smd 3.2 x 1.2: A -3.4,-2; A' 3.4,-2; B -3.4,2; B' 3.4,2
SPDT_SMT_SSSS811101 = smd 0.7 x 1.5: A -2.25,1.75; B 0.75,1.75; C 2.25,1.75 | smd 1 x 0.8: SUP1 -3.65,1.1; SUP2 -3.65,-1.1; SUP3 3.65,1.1; SUP4 3.65,-1.1 | hole 0.9: -1.5,0; 1.5,0
SOT-23 = smd 0.787 x 0.889: 1 0.025,-1.016; 2 -0.94,1.016; 3 0.991,1.016
SOT223-R = smd 1.3 x 1.3: 1 -2.3,-3.05; 2 0,-3.05; 3 2.3,-3.05 | smd 3.6 x 1.3: 4 0,3.05
SOT23-DBV = smd 0.55 x 1.2: 1 -0.95,-1.3; 2 0,-1.3; 3 0.95,-1.3; 4 0.95,1.3; 5 -0.95,1.3
SOIC8_208MIL = smd 0.6 x 2.2: 1 -1.905,-3.315; 2 -0.635,-3.315; 3 0.635,-3.315; 4 1.905,-3.315; 5 1.905,3.315; 6 0.635,3.315; 7 -0.635,3.315; 8 -1.905,3.315
PQFN64-1 = smd 0.7 x 0.22: 1 -4.45,3.75; 2 -4.45,3.25; 3 -4.45,2.75; 4 -4.45,2.25; 5 -4.45,1.75; 6 -4.45,1.25; 7 -4.45,0.75; 8 -4.45,0.25; 9 -4.45,-0.25; 10 -4.45,-0.75; 11 -4.45,-1.25; 12 -4.45,-1.75; 13 -4.45,-2.25; 14 -4.45,-2.75; 15 -4.45,-3.25; 16 -4.45,-3.75; 33 4.45,-3.75; 34 4.45,-3.25; 35 4.45,-2.75; 36 4.45,-2.25; 37 4.45,-1.75; 38 4.45,-1.25; 39 4.45,-0.75; 40 4.45,-0.25; 41 4.45,0.25; 42 4.45,0.75; 43 4.45,1.25; 44 4.45,1.75; 45 4.45,2.25; 46 4.45,2.75; 47 4.45,3.25; 48 4.45,3.75 | smd 0.22 x 0.7: 17 -3.75,-4.45; 18 -3.25,-4.45; 19 -2.75,-4.45; 20 -2.25,-4.45; 21 -1.75,-4.45; 22 -1.25,-4.45; 23 -0.75,-4.45; 24 -0.25,-4.45; 25 0.25,-4.45; 26 0.75,-4.45; 27 1.25,-4.45; 28 1.75,-4.45; 29 2.25,-4.45; 30 2.75,-4.45; 31 3.25,-4.45; 32 3.75,-4.45; 49 3.75,4.45; 50 3.25,4.45; 51 2.75,4.45; 52 2.25,4.45; 53 1.75,4.45; 54 1.25,4.45; 55 0.75,4.45; 56 0.25,4.45; 57 -0.25,4.45; 58 -0.75,4.45; 59 -1.25,4.45; 60 -1.75,4.45; 61 -2.25,4.45; 62 -2.75,4.45; 63 -3.25,4.45; 64 -3.75,4.45 | smd 4.7 x 4.7: EXP 0,0
2X05_1.27MM_BOX_POSTS = smd 0.76 x 2.6: 1 -2.54,-2.15; 2 -2.54,2.15; 3 -1.27,-2.15; 4 -1.27,2.15; 5 0,-2.15; 6 0,2.15; 7 1.27,-2.15; 8 1.27,2.15; 9 2.54,-2.15; 10 2.54,2.15 | hole 1: -1.905,0; 1.905,0
4UCONN_20329_V2 = smd 1 x 2: BASE@1 -0.75,-2; BASE@2 0.75,-2 | smd 0.4 x 1.35: D+ 0,0.775; D- -0.65,0.775; GND 1.3,0.775; ID 0.65,0.775; VBUS -1.3,0.775 | drill 0.8 pad 1.143 offset: SPRT@1 -3.3,0.9; SPRT@2 3.3,0.9 | drill 0.9 pad 2.413 square: SPRT@3 -3.6,-1.9; SPRT@4 3.6,-1.9 | hole 0.7: -1.95,0; 1.95,0
XTAL3215 = smd 1.1 x 1.9: P$1 1.2,0; P$2 -1.2,0
DCJACK_2MM_PTH = drill 1 pad 2.7 long: GND 7.35,0; GNDBREAK 10.75,-4.8; PWR 13.6,0

### Placement (x,y rotation side)
AD  57.15,2.54 0 top
C1  26.78,25.27 225 top
C2  22.99,13.84 180 top
C3  26.54,10.03 0 top
C4  41.78,17.14 270 top
C5  36.83,18.16 270 top
C6  27.92,7.33 90 top
C7  37.72,15.11 180 top
C8  27.55,22.41 135 top
C9  29.37,26.78 135 top
C10  29.94,29.05 315 top
C11  31.66,21.12 45 top
C12  16.89,23.11 0 top
C13  26.54,11.81 180 top
C14  42.28,20.5 90 top
C15  37.54,37.72 270 top
C16  47.14,32.49 180 top
C17  14.35,45.49 90 top
D1  13.74,13.39 180 top
F2  8.76,32.38 270 top
FB2  1.78,44.83 270 top
FD1  10.92,49.28 0 top
FD2  66.16,4.55 0 top
FD3  22.91,3.28 0 top
GROUND1  7.11,44.7 180 bottom
IC3  13.03,29.03 90 top
ICSP  64.64,27.94 270 top
IOH  30.23,50.8 0 top
IOL  54.61,50.8 0 top
JP1  5.46,13.72 0 top
L  3.68,31.62 90 top
L1  29.39,23.8 315 top
LED1  11.3,41.15 180 top
ON  3.56,24.64 270 top
PC1  19.08,10.29 90 top
PC2  21.59,18.26 180 top
POWER  36.83,2.54 0 top
R1  17.78,29.72 90 top
R2  7.24,27.3 270 top
R3  16.02,45.48 90 top
R4  64.14,13.59 270 top
R5  56.13,35.18 180 top
R7  14.1,6.86 90 top
R11  17.32,32.79 0 top
RESET  6.35,49.4 180 top
RXLED  3.56,29.46 270 top
SJ1  17.27,23.37 180 bottom
SW1  2.92,18.8 270 top
T2  13.46,10.29 180 top
TR1  12.7,24.31 90 top
TXLED  3.56,26.92 270 top
U1  12.88,18.44 90 top
U2  24.77,7.37 270 top
U3  55.24,29.46 180 top
U$1  38.3,28.1 135 top
U$23  [METROM4_REVF_TOP]  0,0 0 top
U$27  [METROM4_REVF_BOT]  68.58,0 0 bottom
X2  61.34,19.3 180 top
X3  4.32,38.1 270 top
X4  38.73,17.78 90 top
X5  -3.3,7.75 0 top

### Tracks (layer width: path | path; a pad name or v marks a point on that pad's centre or on a via)
3.3V  (via drill 0.5)
  Top 0.229: U$1.34 37.08,33.91 37.08,34.67 37.47,35.05 v37.47,35.43 37.47,36.8 C15.2 | U$1.56 33.78,23.93 33.78,22.86 | U$1.48 32.1,28.19 31.62,28.67 | 31.62,28.67 v31.62,29.21 | 44.07,11.18 44.32,11.43 44.32,20.19 43.17,21.35 C14.2 42.28,21.8 41.66,22.43 41.66,23.57 41.76,23.67 41.76,24.29 U$1.8 | RXLED.A 2.16,29.46 v1.14,30.48 | U3.8 57.16,26.16 v58.29,26.16 | U$1.21 45.16,32.49 C16.2 46.29,33.11 46.61,33.43 48.84,33.43 49.2,33.78 49.2,36.96 v47.52,38.63 | 31.62,28.67 31.4,28.45 C10.2
  Top 0.254: 33.78,22.86 32.77,21.84 32.64,21.72 C11.2 | 55.24,35.24 55.28,35.2 R5.2
  Top 0.305: v31.11,11.56 31.11,18.92 32.77,20.57 32.77,21.84 | LED1.2 13.07,42.04 v14.48,42.04 | R1.4 19.08,31.02 19.56,31.5 19.56,35.05 v19.3,35.31 | 55.24,35.24 v55.24,38.1 | IC3.5 10.54,28.08 v10.54,29.08
  Top 0.406: ON.A TXLED.A RXLED.A | v61.72,26.67 60.58,26.67 | 44.07,11.18 v43.94,11.05 | X2.1 63.88,23.75 | v65.79,13.46 64.96,13.46 64.23,12.74 R4.2 | R3.1 17.27,43.38 v17.27,42.29
  Top 0.813: v66.04,23.11 65.41,23.75 63.88,23.75 62.48,23.75 60.58,25.65 60.58,26.67 60.58,37.34 v60.45,37.47 | C13.1 27.49,11.71 C3.2
  Top 1.016: POWER.2 30.48,8.18 C6.2 27.92,8.32 | 27.92,8.32 U2.5 | 27.92,8.32 27.92,10.03 C3.2 27.49,10.35 29.27,10.35 v29.34,10.41 | POWER.4 v35.56,9.91
  Bottom 0.229: 2.67,29.08 2.54,29.08 v1.14,30.48
  Bottom 0.254: 9.78,29.08 8.51,29.08 | 8.51,29.08 2.67,29.08 | 19.3,35.43 12.06,35.43 8.51,31.88 8.51,29.08 | v47.52,38.63 47.52,38.1
  Bottom 0.305: v31.11,11.56 31.11,10.41 | v17.27,42.29 17.27,43.31 | 19.56,43.31 19.3,43.05 19.3,35.43 v19.3,35.31 | SJ1.1 10.54,23.37 v10.54,29.08 9.78,29.08
  Bottom 0.406: v58.29,26.16 61.21,26.16 v61.72,26.67 | v43.94,11.05 43.94,10.41 | v31.62,29.21 31.75,29.34 31.75,37.47 | v65.79,13.46 67.06,13.46
  Bottom 0.61: v14.48,42.04 14.35,42.16 14.35,43.31
  Bottom 0.813: 13.21,43.31 14.35,43.31 17.27,43.31 19.56,43.31 24.89,43.31 30.73,37.47 31.75,37.47 35.94,37.47 36.83,38.35 | 36.83,38.35 43.81,38.35 44.07,38.1 47.52,38.1 v55.24,38.1 59.82,38.1 v60.45,37.47 | 36.83,38.35 36.83,36.07 v37.47,35.43
  Bottom 1.016: v29.34,10.41 31.11,10.41 35.56,10.41 | 35.56,10.41 43.94,10.41 44.2,10.41 45.21,11.43 65.91,11.43 67.06,12.57 67.06,13.46 67.06,22.1 v66.04,23.11 | v35.56,9.91 35.56,10.41
!RESET  (via drill 0.5)
  Top 0.229: U$1.52 32.3,25.27 v31.88,25.27 | v55.37,23.11 55.37,19.3 57.53,17.14 X2.10
  Top 0.254: RESET.B' RESET.B 9.78,47.37 v12.19,47.37 | v51.18,44.96 50.67,44.45 50.67,22.86 v50.93,22.61 | POWER.3 33.15,2.67 v33.15,11.68 | v58.8,12.95 X2.10
  Top 0.406: R3.2 17.27,47.59 v17.27,48.13 | R3.2 16,46.32 | C17.2 14.36,46.33 R3.2
  Bottom 0.229: v31.88,25.27 33.4,23.75 40.89,23.75 41.4,24.26 42.93,24.26 43.69,23.5 51.05,23.5 54.74,23.5 55.12,23.11 v55.37,23.11 55.5,22.99 61.09,22.99 63.37,25.27 ICSP.5 | v51.18,44.96 36.75,44.96 34.21,47.5 33.66,47.5
  Bottom 0.254: v12.19,47.37 12.32,47.5 17.27,47.5 33.66,47.5 | v50.93,22.61 51.05,22.73 51.05,23.5 | v33.15,11.68 42.93,11.68 43.94,12.7 58.55,12.7 v58.8,12.95
  Bottom 0.305: v17.27,48.13 17.27,47.5
+5V  (via drill 0.5)
  Top 0.406: ICSP.2 67.44,28.96 67.44,11.81 66.42,10.79 63.37,10.79 61.47,12.7 v61.21,12.7 | v38.1,12.57 POWER.5
  Top 0.61: U2.1 22.41,8.32 22.1,8 22.1,6.73 22.41,6.42 U2.3 23.46,5.21 v24.77,5.21
  Top 1.016: U1.2 15.37,18.44 | 15.37,18.44 U1.4 | PC2.+ 18.41,18.26 | 18.41,18.26 15.54,18.26 15.37,18.44 | 18.41,18.26 22.04,14.64 C2.2 22.1,13.78 22.1,8 | TR1.2 9.68,23.37
  Bottom 0.406: v61.21,12.7 60.07,13.84 58.04,13.84 57.53,13.34 43.69,13.34 42.93,12.57 v38.1,12.57
  Bottom 0.61: v24.77,5.21 38.1,5.21 POWER.5
  other vias: 9.27,24.51 9.14,22.1 12.19,18.54
  pour Bottom (isolate 0.406, no thermals): 0.89,29.72 10.79,29.72 10.79,21.59 12.7,19.68 12.7,16.13 9.27,12.7 0.89,12.7
  pour Top (no thermals): 1.27,12.7 1.27,29.84 10.16,29.84 10.29,22.1 12.95,19.43 12.95,16.13 10.16,13.34 10.16,12.7
A0  (via drill 0.5)
  Top 0.229: U$1.3 40.77,21.74 v40.77,6.6 | v49.78,6.1 50.8,5.08 AD.1
  Bottom 0.229: v40.77,6.6 41.27,6.1 v49.78,6.1
A1  (via drill 0.5)
  Top 0.229: v52.45,8 53.34,7.11 AD.2 | U$1.14 44,26.29 44.7,26.29 47.27,23.72 47.27,9.37 46.74,8.84 v46.74,8
  Bottom 0.229: v46.74,8 v52.45,8
A2  (via drill 0.5)
  Top 0.229: v47.88,4.83 47.88,24 44.96,26.92 44.07,26.92 U$1.15
  Bottom 0.229: v47.88,4.83 48.01,4.7 55.37,4.7 55.88,4.19 AD.3
A3  (via drill 0.5)
  Top 0.229: U$1.13 46.08,23.51 46.08,10.36 v46.2,10.24 | v58.14,10.03 58.14,2.82 AD.4
  Bottom 0.229: v58.14,10.03 57.94,10.24 v46.2,10.24
A4  (via drill 0.5)
  Top 0.229: v59.56,7.11 60.96,5.71 AD.5 | U$1.11 43.51,24.66 43.51,23.98 44.83,22.66 v44.83,7.37
  Bottom 0.229: v44.83,7.37 45.09,7.11 v59.56,7.11
A5  (via drill 0.5)
  Top 0.229: U$1.12 44.02,24.86 44.02,24.18 45.31,22.89 45.31,9.27 v45.62,8.97
  Bottom 0.229: v45.62,8.97 60.6,8.97 63.4,6.17 63.4,2.64 AD.6
AREF  (via drill 0.5)
  Top 0.229: C4.1 42.08,18 v43.05,17.02
  Top 0.254: v23.88,33.15 23.88,23.88 v24,23.75 27.3,20.45 v27.3,18.16 | v23.88,39.12 IOH.3 | U$1.4 41.27,21.94 41.27,18.67 41.78,18.16 C4.1
  Bottom 0.229: 33.53,17.78 42.29,17.78 v43.05,17.02
  Bottom 0.254: v24,23.75 18.41,23.75 SJ1.2 | v23.88,33.15 v23.88,39.12 | v27.3,18.16 27.56,17.91 33.4,17.91 33.53,17.78
D0  (via drill 0.5)
  Top 0.229: v62.99,43.56 63.5,44.07 IOL.8 | v27.94,45.47 27.43,45.47 26.92,44.96 26.92,42.42 28.96,40.39 28.96,34.97 U$1.44
  Bottom 0.229: v27.94,45.47 28.63,45.47 28.68,45.52 32.08,45.52 34.04,43.56 38.58,43.56 39.04,44.02 62.53,44.02 v62.99,43.56
D1  (via drill 0.5)
  Top 0.229: v60.33,42.42 60.96,43.05 IOL.7 | v27.81,44.07 27.81,42.55 29.59,40.77 29.59,35.04 U$1.43
  Bottom 0.229: v27.81,44.07 28.37,43.51 31.65,43.51 32.74,42.42 38.76,42.42 39.09,42.09 59.99,42.09 v60.33,42.42
D2  (via drill 0.5)
  Top 0.254: U$1.40 31.95,34.8 v31.95,40.01 | IOL.6 58.42,41.4 57.78,40.77 v57.71,40.77
  Bottom 0.254: v31.95,40.01 32.38,40.44 34.95,40.44 35.46,40.95 53.85,40.95 54.38,40.41 57.35,40.41 v57.71,40.77
D3  (via drill 0.5)
  Top 0.229: U$1.39 32.89,34.57 v32.89,41.53 | v55.37,41.27 55.37,50.29 IOL.5
  Bottom 0.229: v32.89,41.53 55.12,41.53 v55.37,41.27
D4  (via drill 0.5)
  Top 0.229: U$1.26 43.05,33.91 43.05,46.99 43.43,47.37 v43.43,48.77
  Bottom 0.254: IOL.4 53.34,49.15 52.96,48.77 v43.43,48.77
D5  (via drill 0.5)
  Top 0.229: U$1.27 42.16,33.73 42.16,47.5 v42.29,47.62
  Top 0.254: v50.67,47.88 50.67,50.67 IOL.3
  Bottom 0.254: v42.29,47.62 42.42,47.75 50.55,47.75 v50.67,47.88
D6  (via drill 0.5)
  Top 0.229: U$1.28 41.53,33.8 41.53,45.34 41.27,45.59 v41.27,46.23
  Top 0.254: v47.24,46.74 48.26,47.75 IOL.2
  Bottom 0.254: v41.27,46.23 41.78,46.74 v47.24,46.74
D7
  Top 0.229: U$1.25 43.92,34.07 43.92,46.41 45.72,48.21 IOL.1
D8  (via drill 0.5)
  Top 0.229: U$1.42 30.23,35.11 v30.23,44.53 | v40.01,43 40.01,47.42 41.58,49 41.58,50.72 IOH.10
  Bottom 0.229: v30.23,44.53 32.11,44.53 33.63,43 v40.01,43
D9  (via drill 0.5)
  Top 0.229: U$1.41 31.01,35.03 v31.01,39.09 | v36.52,40.13 36.52,45.57 38.99,48.03 38.99,50.67 IOH.9
  Bottom 0.229: v31.01,39.09 31.8,38.3 35.31,38.3 36.52,39.52 v36.52,40.13
D10
  Top 0.229: U$1.37 34.24,34.63 34.24,47.8 36.58,50.14 IOH.8 36.58,50.42
D11
  Top 0.229: U$1.38 33.73,34.44 33.73,48.9 34.04,49.2 IOH.7
D12  (via drill 0.5)
  Top 0.229: U$1.36 34.82,34.76 34.82,47.12 35.23,47.52 v35.92,47.52 35.94,47.52
  Bottom 0.229: v35.92,47.52 35.38,48.06 32.23,48.06 31.5,48.79 IOH.6
D13  (via drill 0.5)
  Top 0.229: U$1.35 35.69,34.6 v35.69,44.37 | v26.64,46.13 27.15,46.13 28.96,47.93 IOH.5 | R2.8 7.11,29.58 v7.11,31.93 | v18.39,41.86 18.39,45.95 v18.59,46.15
  Bottom 0.229: v35.69,44.37 33.15,46.91 28.02,46.91 27.23,46.13 v26.64,46.13 26.62,46.15 v18.59,46.15 | v7.11,31.93 7.67,31.93 11.81,36.07 18.39,36.07 v18.39,41.86
D+
  Top 0.229: U$1.46 31.85,30.66 arc45 13.89,38.1 X3.D+
D-
  Top 0.229: U$1.45 31.91,31.31 arc45 13.95,38.75 X3.D-
FLASH_CS  (via drill 0.5)
  Top 0.229: v58.29,33.15 57.92,32.78 U3.1 57.08,32.84 | U$1.24 46.07,35.51 v46.13,35.51 | R5.1 58.04,35.18 58.29,34.92 v58.29,34.67
  Top 0.305: 57.08,32.84 56.98,32.95 R5.1
  Bottom 0.229: v46.13,35.51 46.38,35.76 57.35,35.76 58.29,34.82 v58.29,34.67
FLASH_IO0  (via drill 0.5)
  Top 0.229: U$1.17 44.24,28.45 v45.34,28.45 | v52.83,28.45 53.34,27.94 U3.5
  Bottom 0.229: v45.34,28.45 v52.83,28.45
FLASH_IO1  (via drill 0.5)
  Top 0.229: U$1.18 44.14,29.34 v46.23,29.34 | v55.24,29.34 55.88,29.97 U3.2
  Bottom 0.229: v46.23,29.34 v55.24,29.34
FLASH_IO2  (via drill 0.5)
  Top 0.229: U$1.19 44.32,30.23 v44.96,30.23 | v53.98,30.23 54.61,30.86 U3.3
  Bottom 0.229: v44.96,30.23 v53.98,30.23
FLASH_IO3  (via drill 0.5)
  Top 0.229: U$1.20 44.5,31.11 v46.1,31.11 | v58.04,31.11 56.39,29.46 56.39,28.32 55.88,27.81 U3.7
  Bottom 0.229: v46.1,31.11 v58.04,31.11
FLASH_SCK  (via drill 0.5)
  Top 0.229: U$1.23 43.01,31.75 43.05,31.75 45.64,34.34 v47.83,34.34 | v52.07,32.26 52.07,30.61 54.61,28.07 U3.6
  Bottom 0.229: v47.83,34.34 51.71,34.34 52.07,33.98 v52.07,32.26
GND  (via drill 0.5)
  Top 0.229: C14.1 43.81,19.65 43.81,17.02
  Top 0.254: L.C 1.17,31.62 0.41,32.38 0.41,35.87 0.81,36.27 3.3,36.27 3.94,36.91 4.37,36.91 4.47,36.8 X3.GND | 5.82,21.05 6.77,21.05 7.87,19.94 7.87,16.38 8.51,15.75 13.97,15.75 14.1,15.88
  Top 0.406: SW1.A 5.82,21.05 6.31,21.05 8.09,22.82 R2.5 | X3.GND 7.09,36.8 7.09,36.75
  other vias: 38.23,30.35 40.89,28.07 35.81,28.07 38.35,25.53 37.21,26.92 37.21,29.08 39.37,29.34 38.35,27.94 39.5,27.05 47.37,27.18 49.28,25.65 50.55,20.7 50.67,16.76 35.81,13.34 29.72,16.64 12.7,33.66 16.38,34.42 19.94,29.84 25.15,27.81 27.43,36.32 24.94,40.03 27.56,48.51 25.15,48.51 42.04,13.84 10.01,36.14
  pour Bottom (rank 5): 0,53.34 68.58,53.34 68.58,0 0,0
  pour Top (rank 5): 0,53.34 68.58,53.34 68.58,0 0,0 0,11.05 13.34,11.05 13.34,29.97 0,29.97
MISO  (via drill 0.5)
  Top 0.229: v38.1,40.01 38.1,39.62 38.48,39.24 38.48,35.41 39.47,34.42 39.47,33.86 U$1.31 | ICSP.1 63.37,39.37 v62.99,39.75
  Bottom 0.229: v38.1,40.01 38.35,39.75 v62.99,39.75
MOSI  (via drill 0.5)
  Top 0.229: U$1.29 41.02,34 41.02,36.7 40.77,36.96 v40.51,36.96 | ICSP.4 64.64,29.21 v64.64,33.02
  Bottom 0.229: v64.64,33.02 64.64,33.66 62.15,36.14 60.12,36.14 59.16,37.11 41.35,37.11 41.2,36.96 v40.51,36.96
N$1
  Top 0.406: R2.1 6.39,29.97 L.A
N$2  (via drill 0.5)
  Top 0.254: FB2.1 3.62,45.78 v4.83,44.58
  Bottom 0.254: v4.83,44.58 6.22,44.58 GROUND1.1
N$3
  Top 0.406: R2.4 5.02,24.64 ON.C
N$4
  Top 0.229: U$1.55 32.15,23 L1.P$2
N$5
  Top 0.406: R2.2 5.82,27.7 4.61,28.92 RXLED.C
N$7
  Top 0.406: R2.3 6.37,26.92 TXLED.C
N$9
  Top 0.229: U$1.1 39.24,21.85 39.24,19.49 X4.P$1 38.7,19.01 C5.1
N$10
  Top 0.229: 16.37,31.07 16.43,31.07 16.88,31.07 R1.5 16.42,31.02 16.39,30.99
  Top 0.254: IC3.2 14.32,29.08 15.37,29.08 15.37,30.61 15.75,30.99 16.39,30.99 | X3.ID 11.71,37.45 16.37,32.79 R11.1 16.47,31.11 16.43,31.07
  Top 0.406: IC3.1 IC3.2
N$11  (via drill 0.5)
  Top 0.254: 11.84,25.3 TR1.3 11.91,25.53 v12.83,25.53 | IC3.4 12.19,30.44 v12.19,30.99 12.19,32.64 11.43,33.4 11.43,34.04 12.32,34.92 12.95,34.92 v14.86,33.02 | R1.7 R1.8 16.1,28.42 v15.62,27.94
  Bottom 0.254: v14.86,33.02 15.62,32.26 v15.62,27.94 | v12.19,30.99 13.08,30.99 13.08,25.65 12.95,25.53 v12.83,25.53
N$12
  Top 0.229: C7.1 38.57,16.41 X4.P$2 38.93,16.38 39.5,16.38 40.13,17.02 40.13,21.67 U$1.2
N$15  (via drill 0.5)
  Top 0.406: 14.4,8.11 14.1,7.81 R7.2
  Top 0.61: 14.4,8.11 T2.2 14.78,9.65 v15.75,9.65 | v17.27,13.08 16.97,13.39 D1.C
  Bottom 0.61: v15.75,9.65 17.27,11.18 v17.27,13.08
NEOPIX  (via drill 0.5)
  Top 0.229: U$1.49 32.36,27.46 31.04,27.46 30.66,27.08 30.53,27.08
  Top 0.254: 13.05,40.36 LED1.1 18.43,40.27 v20.19,42.04 | 30.53,27.08 27.1,30.5 v27.1,30.53
  Bottom 0.254: v27.1,30.53 26.26,31.37 26.26,40.18 24.41,42.04 v20.19,42.04
PWR_SWITCH  (via drill 0.5)
  Top 0.254: SW1.B 6.46,18.05 7.11,17.4 7.11,15.37 JP1.1
  Top 0.406: 14.03,5.84 14.1,5.91 R7.1
  Top 0.61: 14.03,5.84 13.21,5.84 12.47,6.58 T2.3 12.47,9.3 12.32,9.45 v12.32,10.41
  Bottom 0.254: JP1.1 5.46,12.57 6.6,11.43 11.81,11.43 12.32,10.92 v12.32,10.41
PWRIN
  Top 1.016: X5.PWR 10.3,10.43 11.94,12.06 11.94,13.34 D1.A
RXLED  (via drill 0.5)
  Top 0.229: U$1.9 42.55,24.21 v42.55,23.11
  Top 0.254: v20.7,22.73 20.32,23.11 20.32,27.56 20.19,27.69 17.4,27.69 16.64,26.92 10.16,26.92 9.38,27.7 R2.7
  Bottom 0.229: v20.7,22.73 41.91,22.73 42.29,23.11 v42.55,23.11
SCK  (via drill 0.5)
  Top 0.229: U$1.30 40.13,33.82 v40.13,35.18 | ICSP.3 62.61,27.94 61.98,28.57 61.98,34.8 v61.72,35.05
  Bottom 0.229: v40.13,35.18 41.48,36.52 58.6,36.52 60.07,35.05 v61.72,35.05
SCL  (via drill 0.5)
  Top 0.229: U$1.64 38.1,22.01 v38.1,20.7 | v22.73,20.57 22.1,21.21 22.1,32.26 v21.46,32.89 | 18.8,50.55 IOH.1 18.8,49.78 21.08,47.5 21.08,41.15 v21.21,41.02
  Bottom 0.229: v38.1,20.7 37.85,20.45 35.69,20.45 35.31,20.83 25.53,20.83 24.77,20.07 23.24,20.07 v22.73,20.57 | v21.46,32.89 21.21,33.15 v21.21,41.02
SDA  (via drill 0.5)
  Top 0.229: U$1.63 36.96,22.16 v36.96,21.34 | v24.13,20.95 22.86,22.23 22.86,33.78 v22.61,34.04 | IOH.2 21.34,49.28 22.61,48.01 v22.61,40.26
  Bottom 0.229: v22.61,34.04 v22.61,40.26
  Bottom 0.254: v36.96,21.34 24.51,21.34 v24.13,20.95
SWCLK  (via drill 0.5)
  Top 0.229: U$1.57 34.42,23.86 34.42,21.34 32.51,19.43 32.54,19.41 v32.54,14.17 | v62.36,14.86 62.61,15.11 X2.4
  Top 0.305: 63.19,14.54 63.28,14.44 R4.1
  Top 0.406: 62.61,15.11 63.19,14.54
  Bottom 0.229: v32.54,14.17 32.61,14.1 34.85,14.1 35.61,14.86 v62.36,14.86
SWDIO  (via drill 0.5)
  Top 0.229: U$1.58 34.92,23.66 34.92,20.95 33.67,19.7 33.67,15.25 v33.66,15.24 | v65.53,15.88 64.25,17.15 X2.2
  Bottom 0.229: v65.53,15.88 60.96,15.88 60.58,15.49 34.8,15.49 34.54,15.24 v33.66,15.24
SWO  (via drill 0.5)
  Top 0.229: U$1.59 35.43,23.46 v35.43,18.92 | v61.34,19.3 X2.6
  Bottom 0.229: v35.43,18.92 35.56,18.8 57.28,18.8 58.04,18.03 60.45,18.03 61.34,18.92 v61.34,19.3
TXLED  (via drill 0.5)
  Top 0.254: U$1.51 32.6,26.29 32,26.29 31.75,26.54 v31.62,26.54 | R2.6 9.16,26.91 9.65,26.42 17.02,26.42 17.27,26.67 v18.92,26.67
  Bottom 0.229: 31.5,26.67 v18.92,26.67
  Bottom 0.254: v31.62,26.54 31.5,26.67
USB_HOSTEN  (via drill 0.5)
  Top 0.229: U$1.10 43,24.46 43,23.85 43.94,22.91 v43.94,22.1 | v17.65,25.65 18.67,25.65 19.43,24.89
  Top 0.254: 18.27,34.43 18.27,32.89 R11.2
  Top 0.305: 18.27,34.43 v18.16,34.54 | 19.43,24.89 v19.43,21.72
  Bottom 0.229: 22.48,22.23 43.31,22.23 43.43,22.1 v43.94,22.1
  Bottom 0.254: v17.65,25.65 17.65,34.04 v18.16,34.54
  Bottom 0.305: v19.43,21.72 21.97,21.72 22.48,22.23
USBVCC  (via drill 0.5)
  Top 1.016: F2.2 9.5,30.96 v10.79,32.26 | v14.61,25.27 14.61,25.22 TR1.1
  Bottom 1.016: v10.79,32.26 13.59,32.26 14.1,31.75 14.1,25.78 v14.61,25.27
USHIELD
  Top 0.229: 2.72,41.4 2.72,39.25 X3.BASE@1 X3.BASE@2 2.42,37.25
  Top 0.254: FB2.2 2.42,43.88 X3.SPRT@3
  Top 0.406: X3.SPRT@2 4.92,34.5 X3.SPRT@4 | X3.SPRT@3 2.72,41.4 X3.SPRT@1
  pour Bottom: 0.13,43.05 0.13,32.89 6.35,32.89 6.35,43.05
  pour Top (rank 2): 0.13,43.05 0.13,32.89 6.35,32.89 6.35,43.05
VBUS  (via drill 0.5)
  Top 0.406: X3.VBUS 6.89,39.4 v7.75,40.26 | v8.26,35.31 8.26,34.31 F2.1
  Bottom 0.406: v7.75,40.26 7.75,35.81 v8.26,35.31
VDDCORE
  Top 0.229: U$1.53 31.99,24.26 31.5,24.26 29.98,25.78 C9.1
  Top 0.406: C9.1 28.59,24.8 L1.P$1 | C1.1 28.59,24.8 L1.P$1 | C8.2 28.54,24.6 L1.P$1
VIN  (via drill 0.5)
  Top 0.254: 15.88,23.18 15.94,23.11 C12.1
  Top 0.305: R1.1 20.48,28.42 21.34,27.56 21.34,24.89 v21.21,24.77
  Top 0.406: 15.88,23.18 v15.88,25.02
  Top 0.813: POWER.8 45.72,4.57 v41.91,8.38 | v20.19,10.29 20.19,10.41 19.05,11.56 | 15.94,20.75 16.04,20.85 C12.1
  Top 1.016: T2.1 18.8,11.3 19.05,11.56 19.18,11.68 19.18,12.84 PC1.+ 19.07,13.95 v17.78,15.24 | 15.94,20.75 U1.3 15.97,20.7 v17.78,20.7
  Bottom 0.305: v21.21,24.77 21.08,24.64 16.26,24.64 v15.88,25.02
  Bottom 0.813: v41.91,8.38 22.1,8.38 v20.19,10.29
  Bottom 1.016: v17.78,15.24 v17.78,20.7

### Text on the board
tNames: SCL | SDA | AREF | GND | 1 | ANALOG IN | IOREF | RESET | 3V3 | 5V | GND | VIN | A0 | A1 | A2 | A3 | A4 | A5
214bmp: D:/SmartProjects/Snc/a4_bn_logo2.bmp